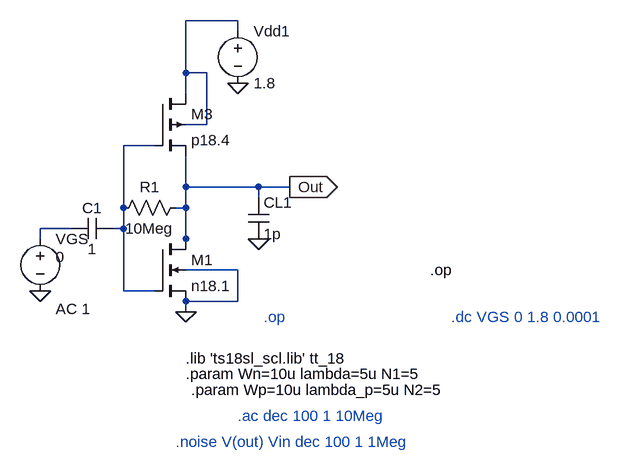
[diagram p0: schematic Q4_e_char.asc]
Q4_e_char.asc, the LTspice schematic file:
Version 4.1
SHEET 1 972 680
WIRE 400 -80 320 -80
WIRE 400 -64 400 -80
WIRE 320 0 320 -80
WIRE 352 0 320 0
WIRE 320 32 320 0
WIRE 352 80 352 0
WIRE 352 80 320 80
WIRE 272 112 224 112
WIRE 320 176 320 128
WIRE 432 176 320 176
WIRE 480 176 432 176
WIRE 432 192 432 176
WIRE 224 208 224 112
WIRE 320 208 320 176
WIRE 320 208 304 208
WIRE 144 240 96 240
WIRE 224 240 224 208
WIRE 224 240 208 240
WIRE 96 256 96 240
WIRE 320 256 320 208
WIRE 320 272 320 256
WIRE 400 304 320 304
WIRE 224 336 224 240
WIRE 272 336 224 336
WIRE 400 352 400 304
WIRE 400 352 320 352
WIRE 320 368 320 352
FLAG 400 16 0
FLAG 320 368 0
FLAG 96 336 0
FLAG 480 176 Out
IOPIN 480 176 Out
FLAG 432 256 0
SYMBOL voltage 400 -80 R0
WINDOW 123 0 0 Left 0
WINDOW 39 0 0 Left 0
SYMATTR InstName Vdd1
SYMATTR Value 1.8
SYMBOL nmos4 272 256 R0
SYMATTR InstName M1
SYMATTR Value n18.1
SYMATTR Value2 l={2*lambda} w={N1*Wn} ad={5*lambda*Wn} as={5*lambda*Wn} pd={2*Wn + 10*lambda} ps={2*Wn + 10*lambda}
SYMBOL voltage 96 240 R0
WINDOW 123 24 124 Left 2
WINDOW 39 0 0 Left 0
WINDOW 3 24 44 Left 2
SYMATTR Value2 AC 1
SYMATTR Value 0
SYMATTR InstName VGS
SYMBOL pmos4 272 32 R0
SYMATTR InstName M3
SYMATTR Value p18.4
SYMATTR Value2 l={2*lambda_p} w={4*N2*Wp} ad={5*lambda_p*Wp} as={5*lambda_p*Wp} pd={2*Wp + 10*lambda_p} ps={2*Wp + 10*lambda_p}
SYMBOL cap 416 192 R0
SYMATTR InstName CL1
SYMATTR Value 1p
SYMBOL res 320 192 R90
WINDOW 0 0 56 VBottom 2
WINDOW 3 32 56 VTop 2
SYMATTR InstName R1
SYMATTR Value 10Meg
SYMBOL cap 208 224 R90
WINDOW 0 0 32 VBottom 2
WINDOW 3 32 32 VTop 2
SYMATTR InstName C1
SYMATTR Value 1
TEXT 320 464 Left 2 !.param Wn=10u lambda=5u N1=5
TEXT 320 440 Left 2 !.lib 'ts18sl_scl.lib' tt_18
TEXT 400 528 Left 2 ;.ac dec 100 1 10Meg
TEXT 328 488 Left 2 !.param Wp=10u lambda_p=5u N2=5
TEXT 304 568 Left 2 ;.noise V(out) Vin dec 100 1 1Meg
TEXT 440 376 Left 2 ;.op
TEXT 728 376 Left 2 ;.dc VGS 0 1.8 0.0001
TEXT 696 304 Left 2 !.op

The netlist it stands for:
* Q4_e_char.asc
Vdd1 N001 0 1.8
M1 Out N002 0 0 n18.1 l={2*lambda} w={N1*Wn} ad={5*lambda*Wn} as={5*lambda*Wn} pd={2*Wn + 10*lambda} ps={2*Wn + 10*lambda}
VGS N003 0 0 AC 1
M3 N001 N002 Out N001 p18.4 l={2*lambda_p} w={4*N2*Wp} ad={5*lambda_p*Wp} as={5*lambda_p*Wp} pd={2*Wp + 10*lambda_p} ps={2*Wp + 10*lambda_p}
CL1 Out 0 1p
R1 Out N002 10Meg
C1 N002 N003 1
.model NMOS NMOS
.model PMOS PMOS
.lib standard.mos
.param Wn=10u lambda=5u N1=5
.lib 'ts18sl_scl.lib' tt_18
* .ac dec 100 1 10Meg
.param Wp=10u lambda_p=5u N2=5
* .noise V(out) Vin dec 100 1 1Meg
* .op
* .dc VGS 0 1.8 0.0001
.op
.backanno
.end